# Altium schematic sheet E17-04-TSVP.SchDoc
size A; DocumentNumber: 4; SheetNumber: 4; SheetTotal: 18
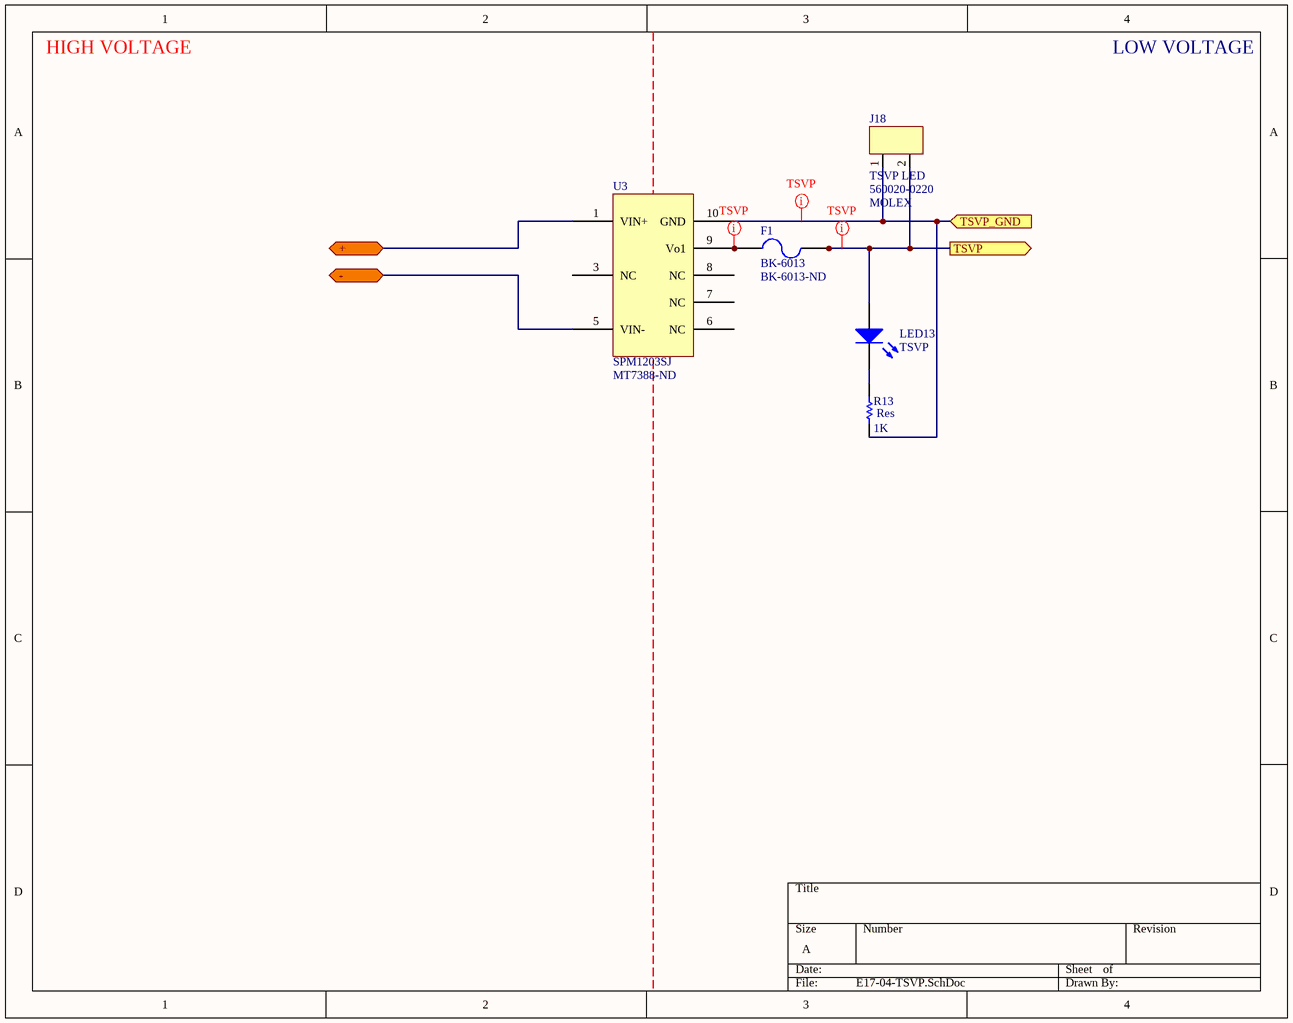
[diagram p0: E17-04-TSVP.SchDoc]

## Parts
F1  BK-6013  Supplier Part Number 1: BK-6013-ND  [BK-6013]
J18  TSVP LED  MANUFACTURER: MOLEX  [MOLEX_DURACLIK_2 NAT VERT]
LED13  TSVP  [155124VS73200]
R13  Res  value 1K  [2012[0805]]
U3  SPM1203SJ  Supplier Part Number 1: MT7388-ND  [SPM1203SJ]

## Ports
+, -, TSVP (out), TSVP_GND (in)

## Nets
+: U3.1(VIN+) ; port +
-: U3.5(VIN-) ; port -
TSVP: F1.3 F1.4 J18.2 LED13.2 ; port TSVP
TSVP_GND: J18.1 R13.1 U3.10(GND) ; port TSVP_GND
NetF1_1: F1.1 F1.2 U3.9(Vo1)
NetLED13_1: LED13.1 R13.2

Not connected (* = marked no-connect by the designer): U3 3(NC) 6(NC) 7(NC) 8(NC)

## Layout directives
rule Undefined; rule Width Constraint [Pref Width = 25mil    Min Width = 20mil    Max Width = 30mil]: NetF1_1, TSVP, TSVP_GND

## Notes on the sheet
- HIGH VOLTAGE
- LOW VOLTAGE

## Library data of the parts
F1 = BK-6013: FUSE HOLDER BLADE PCB; Supplier 1: Digi-Key
J18 = 560020-0220: MOLEX DURACLIK 2-PIN VERT NAT; POSITIONS: 2; UL: 94V-0; VOLTAGE: 125; CURRENT: 3; PLATING: Tin (Sn); Digikey_PN: Not in production; COLOR: NAT; SERIES: Duraclik; ORIENTATOIN: VERT; MPN: 560020-0220; Comment_1: 560020-0220
LED13 = 155124VS73200: Right Angle SMD Green 2V; Manufacturer: Wurth Electronics Inc; Lens Color: Colorless; Lens Transparency: Clear; Millicandela Rating: 50mcd; Lens Style/Size: Rectangle with Domed Top, 2.00mm x 1.00mm; Current - Test: 20mA; Viewing Angle: 120°; Wavelength - Dominant: 573nm; Wavelength - Peak: 575nm; Supplier 1: Digi-Key; Supplier Part Number 1: 732-5026-1-ND; RoHS: RoHS Compliant; Category: Optoelectronics; Stock 1: 4820; Pricing 1: 1=0.44, 50=0.3802, 100=0.3476, 500=0.31498, 1000=0.29326 (CAD); Packaging: Cut Tape (CT); Color: Green; Voltage - Forward (Vf) (Typ): 2V; Mounting Type: Surface Mount, Right Angle; Features: -; Package / Case: 2-SMD, Side View; Supplier Device Package: 1204; Size / Dimension: 3.20mm L x 1.50mm W; Height (Max): 1.20mm; ComponentLink1URL: http://katalog.we-online.de/led/datasheet/155124VS73200.pdf; ComponentLink1Description: http://katalog.we-online.de/led/datasheet/155124VS73200.pdf; Manufacturer Part Number: 155124VS73200
R13 = Res: Surface Mount Resistor; Published: 8-Jun-2000; LatestRevisionDate: 17-Jul-2002; LatestRevisionNote: Re-released for DXP Platform.; PackageReference: AXIAL-0.5; Publisher: Altium Limited
U3 = SPM1203SJ: Supplier 1: Digi-Key